# EAGLE design module (EAGLE 9.4.0)
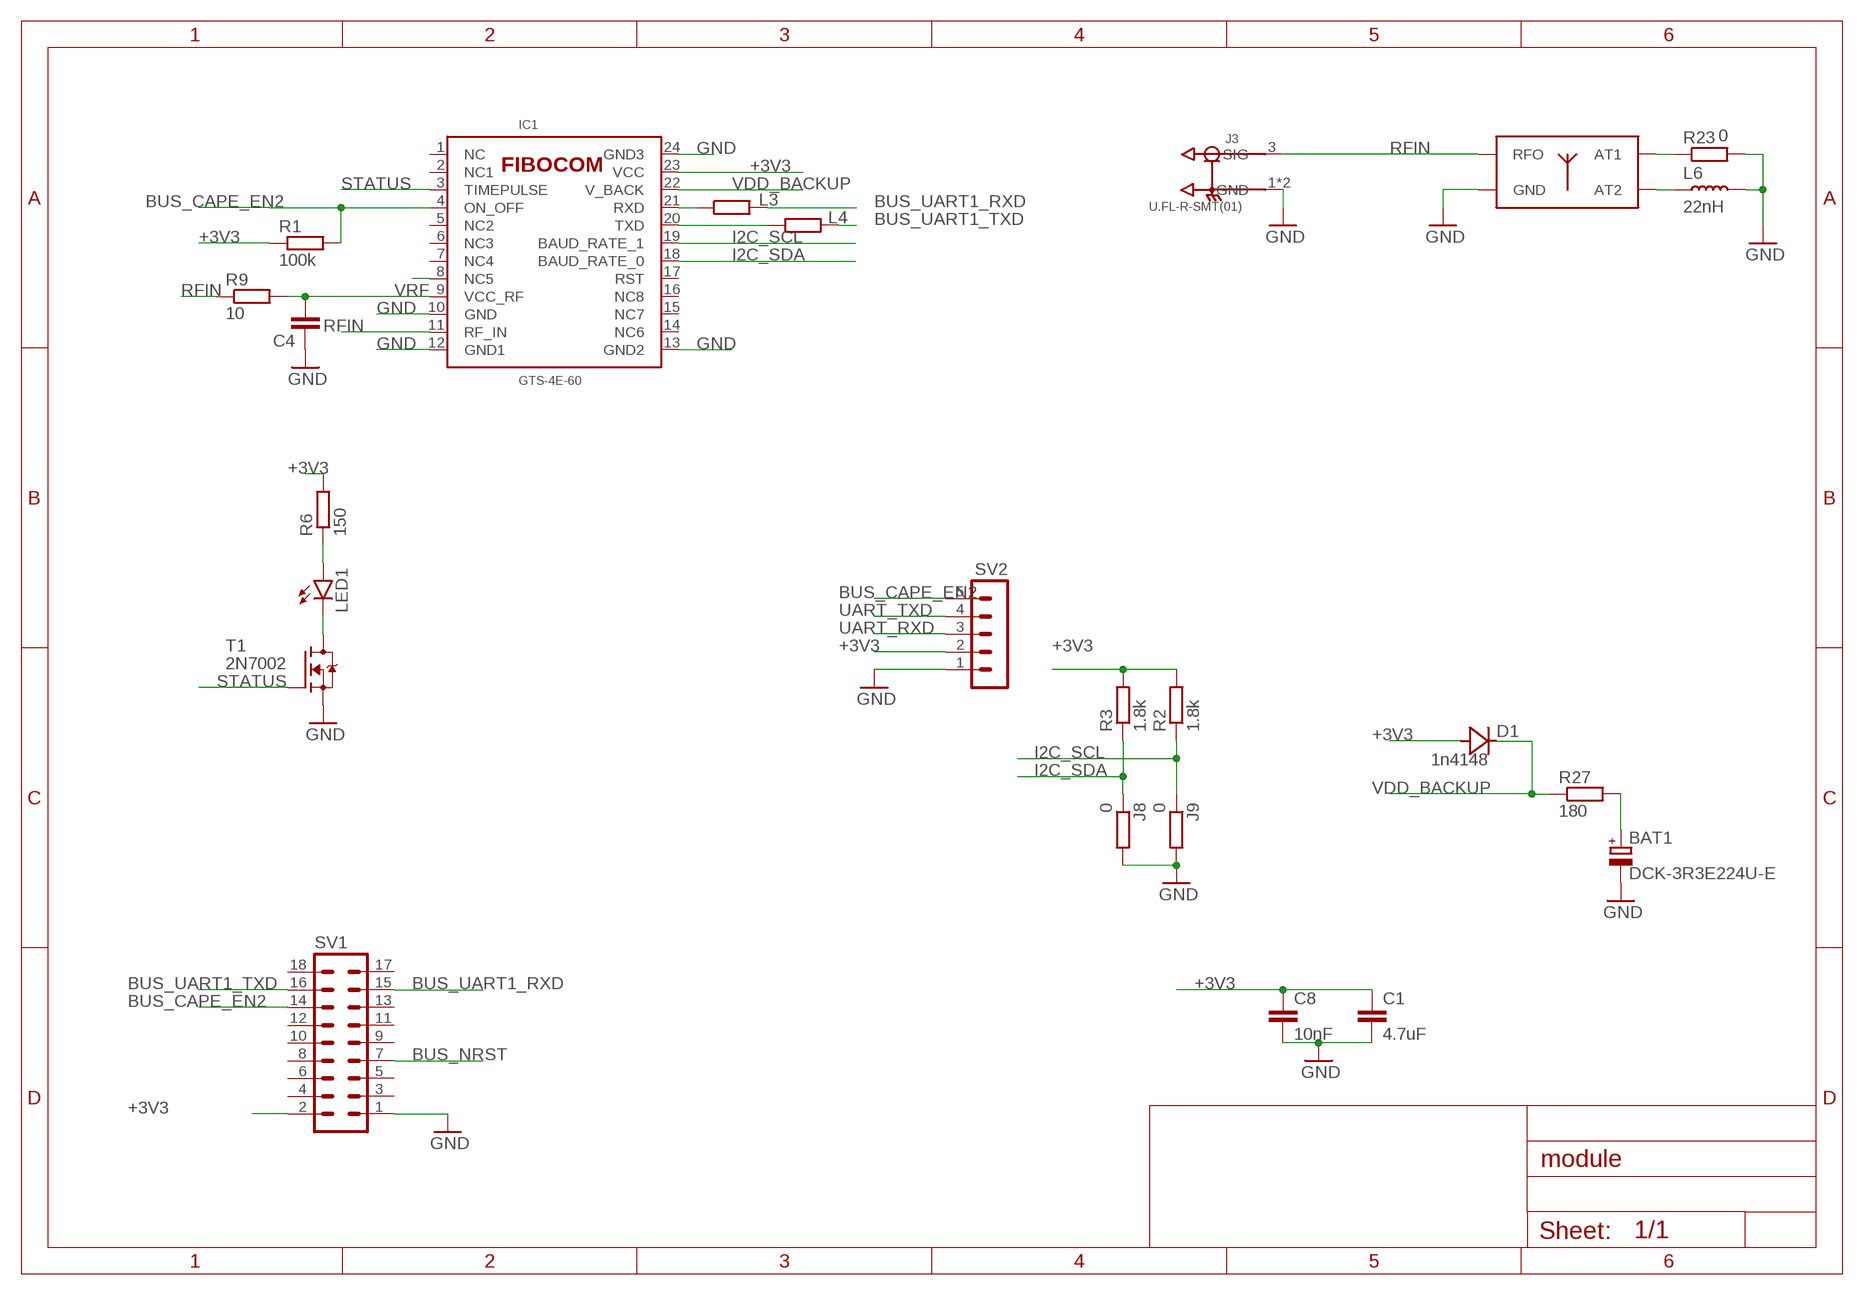
[diagram p0: schematic, sheet 1]

## Parts
ANT1  M20047  [PCBCOMPONENT_1]
BAT1  DCK-3R3E224U-E  [621]
C1  4.7uF  CAP-0603  [C0603]
C4  10nF  CAP-0402  [C0402K]
C8  10nF  CAP-0603  [C0603]
D1  1n4148  1N4148WS  [SOD323]
IC1  GTS-4E-60  [_GTS_4E_60]
J3  U.FL-R-SMT(01)  [HRS_U.FL-R-SMT(01)]
J8  0  RES-0603  [R0603]
J9  0  RES-0603  [R0603]
L3  blm15  RES-0603  [R0603]
L4  blm15  RES-0603  [R0603]
L6  22nH  IND-0402  [L0402]
LED1  LEDCHIP-LED0603  [CHIP-LED0603]
R1  100k  RES-0603  [R0603]
R2  1.8k  RES-0603  [R0603]
R3  1.8k  RES-0603  [R0603]
R6  150  RES-0603  [R0603]
R9  10  R-EU_R0402  [R0402]
R23  0  R-EU_R0402  [R0402]
R27  180  RES-0603  [R0603]
SV1  MA09-2  [MA09-2]
SV2  MA05-1  [MA05-1]
T1  2N7002  [SOT95P240X110-3]

## Nets
+3V3: C1.1 C8.1 D1.A IC1.23(VCC) R1.1 R2.2 R3.2 R6.2 SV1.2 SV2.2
BUS_CAPE_EN2: IC1.4(ON_OFF) R1.2 SV1.14 SV2.5
BUS_NRST: SV1.7
BUS_UART1_RXD: L3.2 SV1.15
BUS_UART1_TXD: L4.2 SV1.16
GND: ANT1.2(GND) ANT1.3(GND) ANT1.4(GND) BAT1.- C1.2 C4.1 C8.2 IC1.10(GND) IC1.12(GND1) IC1.13(GND2) IC1.24(GND3) J3.1(GND) J3.2(GND) J8.2 J9.2 L6.2 R23.2 SV1.1 SV2.1 T1.2(S)
I2C_SCL: IC1.19(BAUD_RATE_1) J9.1 R2.1
I2C_SDA: IC1.18(BAUD_RATE_0) J8.1 R3.1
N$1: IC1.8(NC5)
N$6: LED1.C T1.3(D)
N$12: LED1.A R6.1
N$17: ANT1.1(AT1) R23.1
N$18: ANT1.6(AT2) L6.1
N$20: BAT1.+ R27.2
RFIN: ANT1.5(RFO) IC1.11(RF_IN) J3.3(SIG) R9.1
STATUS: IC1.3(TIMEPULSE) T1.1(G)
UART_RXD: IC1.20(TXD) L4.1 SV2.3
UART_TXD: IC1.21(RXD) L3.1 SV2.4
VDD_BACKUP: D1.K(C) IC1.22(V_BACK) R27.1
VRF: C4.2 IC1.9(VCC_RF) R9.2
Unconnected: IC1.1(NC) IC1.2(NC1) IC1.5(NC2) IC1.6(NC3) IC1.7(NC4) IC1.14(NC6) IC1.15(NC7) IC1.16(NC8) IC1.17(RST) SV1.3 SV1.4 SV1.5 SV1.6 SV1.8 SV1.9 SV1.10 SV1.11 SV1.12 SV1.13 SV1.17 SV1.18

## Library data of the parts
ANT1 = parts-antenova:M20047
BAT1 = parts-elna:DCK-3R3E224U-E
C1 C8 = parts-passives:CAP-; PACKAGE: 0603; RATING: 10V
C4 = parts-passives:CAP-; PACKAGE: 0402; RATING: 6V
D1 = parts-diotec:1N4148WS
IC1 = parts-fibocom:GTS-4E-60: The GTS-4E is a new generation of GPS receiving module. FIBOCOM GTS 4E 60
J3 = parts-molex:U.FL-R-SMT(01): U.FL Series 6 Ghz 50 Ohm Ultra-small SMT Coaxial Cable Receptacle; AVAILABILITY: Unavailable; DESCRIPTION: U.FL Series 6 Ghz 50 Ohm Ultra-small SMT Coaxial Cable Receptacle; MF: Hirose; MP: U.FL-R-SMT_01_; PACKAGE: None; PRICE: None
J8 J9 L3 L4 R1-R3 R6 R27 = parts-passives:RES-; PACKAGE: 0603
L6 = parts-passives:IND-; CURRENT: 10mA; PACKAGE: 0402
LED1 = led:LED: LED OSRAM: - CHIPLED LG R971, LG N971, LY N971, LG Q971, LY Q971, LO R971, LY R971 LH N974, LH R974 LS Q976, LO Q976, LY Q976 LO Q996 - Hyper CHIPLED LW Q18S LB Q993, LB Q99A, LB R99A - SideLED LS A670, LO A670, LY A670, LG A670, LP A670 LB A673, LV A673, LT A673, LW A673 LH A674 LY A675 LS A676, LA A676, LO A676, LY A676, LW A676 LS A679, LY A679, LG A679 - Hyper Micro SIDELED® LS Y876, LA Y876, LO Y876, LY Y876 LT Y87S - SmartLED LW L88C, LW L88S LB L89C, LB L89S, LG L890 LS L89K, LO L89K, LY L89K LS L896, LA L896, LO L896, LY L896 - TOPLED LS T670, LO T670, LY T670, LG T670, LP T670 LSG T670, LSP T670, LSY T670, LOP T670, LYG T670 LG T671, LOG T671, LSG T671 LB T673, LV T673, LT T673, LW T673 LH T674 LS T676, LA T676, LO T676, LY T676, LB T676, LH T676, LSB T676, LW T676 LB T67C, LV T67C, LT T67C, LS T67K, LO T67K, LY T67K, LW E67C LS E67B, LA E67B, LO E67B, LY E67B, LB E67C, LV E67C, LT E67C LW T67C LS T679, LY T679, LG T679 LS T770, LO T770, LY T770, LG T770, LP T770 LB T773, LV T773, LT T773, LW T773 LH T774 LS E675, LA E675, LY E675, LS T675 LS T776, LA T776, LO T776, LY T776, LB T776 LHGB T686 LT T68C, LB T68C - Hyper Mini TOPLED® LB M676 - Mini TOPLED Santana® LG M470 LS M47K, LO M47K, LY M47K Source: http://www.osram.convergy.de LUXEON: - LUMILED® LXK2-PW12-R00, LXK2-PW12-S00, LXK2-PW14-U00, LXK2-PW14-V00 LXK2-PM12-R00, LXK2-PM12-S00, LXK2-PM14-U00 LXK2-PE12-Q00, LXK2-PE12-R00, LXK2-PE12-S00, LXK2-PE14-T00, LXK2-PE14-U00 LXK2-PB12-K00, LXK2-PB12-L00, LXK2-PB12-M00, LXK2-PB14-N00, LXK2-PB14-P00, LXK2-PB14-Q00 LXK2-PR12-L00, LXK2-PR12-M00, LXK2-PR14-Q00, LXK2-PR14-R00 LXK2-PD12-Q00, LXK2-PD12-R00, LXK2-PD12-S00 LXK2-PH12-R00, LXK2-PH12-S00 LXK2-PL12-P00, LXK2-PL12-Q00, LXK2-PL12-R00 Source: www.luxeon.com KINGBRIGHT: KA-3528ASYC Source: www.kingbright.com
R9 R23 = rcl:R-EU_: RESISTOR, European symbol; SPICEPREFIX: R
SV1 = con-lstb:MA09-2: PIN HEADER; OC_FARNELL: unknown; OC_NEWARK: unknown
SV2 = parts-passives:MA05-1: PIN HEADER; OC_FARNELL: unknown; OC_NEWARK: unknown
T1 = parts-onsemi:2N7002

## Net classes
1 50_feed: width 1 mm, clearance 0.4 mm
2 usb_dif: width 0.4 mm, clearance 0.8 mm

## Board
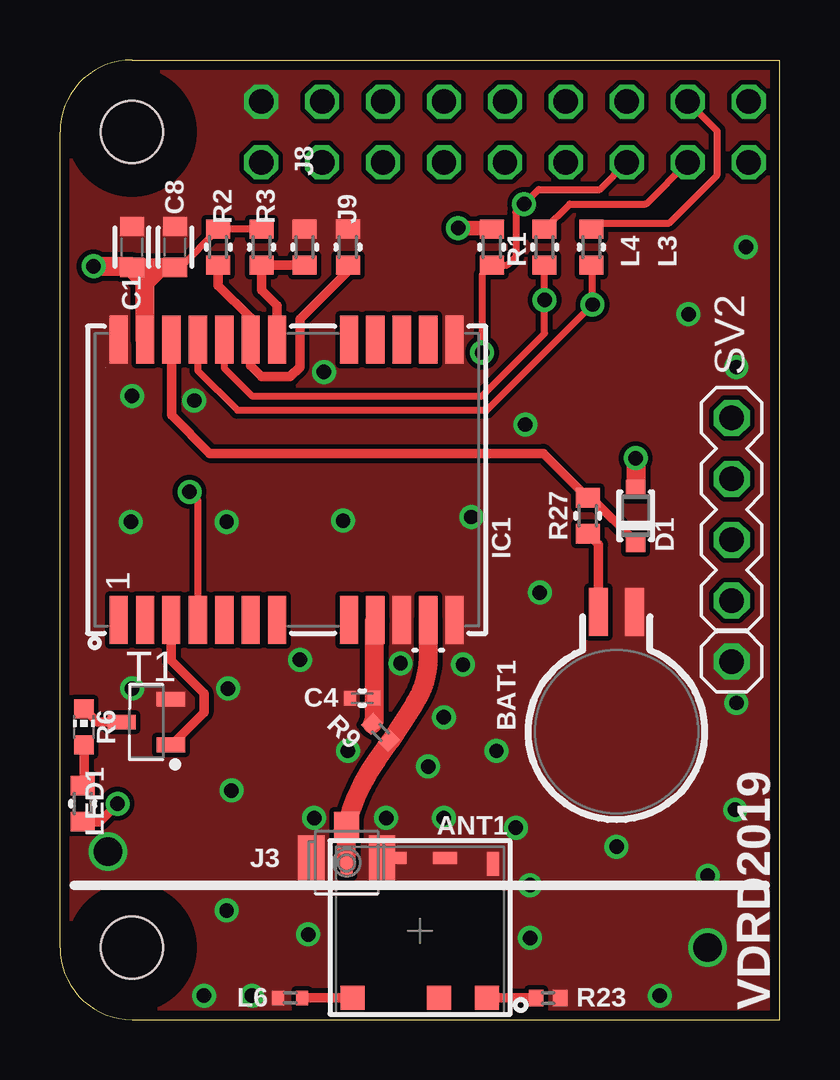
[diagram p1: board, top side]
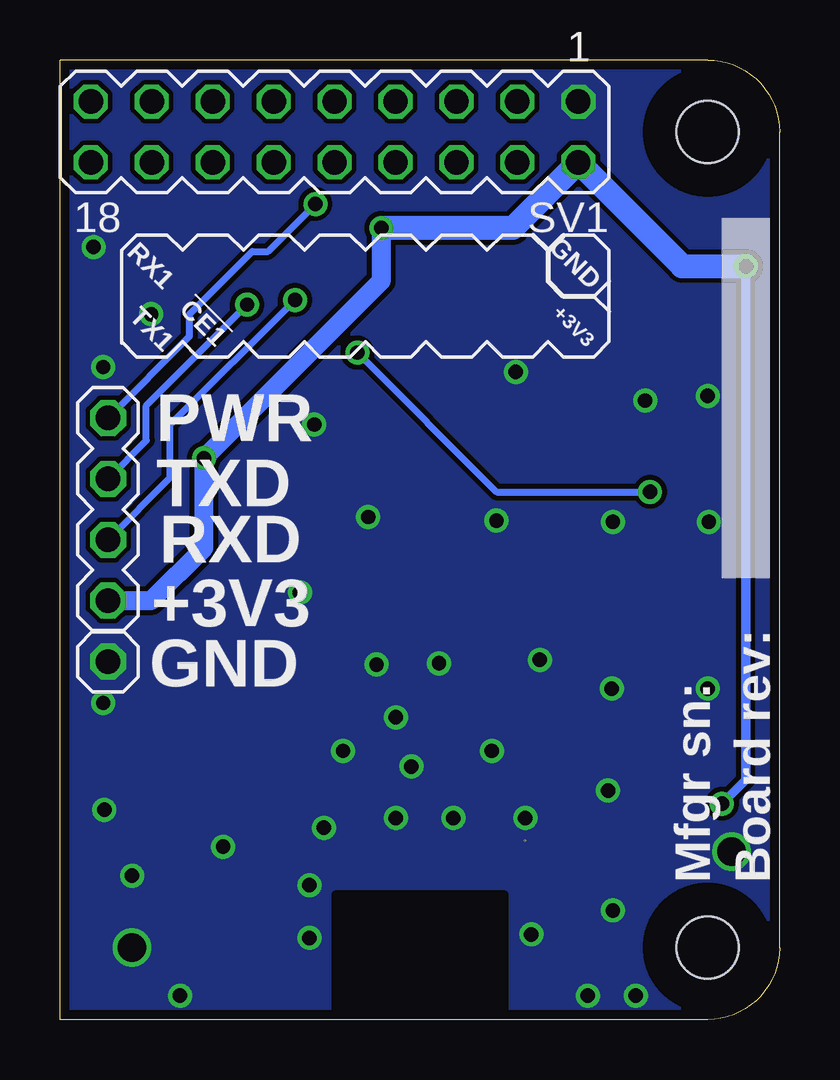
[diagram p2: board, bottom side, seen from below]

Size 30 x 40 mm. Coordinates in mm from the lower left corner, seen from the top.
Outline: 3,40 30,40 30,0 3,0 arc-90 0,3 0,37 arc-90 3,40
Copper layers (1*16): Top 0.035mm / dielectric 0.53mm / Bottom 0.035mm
Design rules "default *": minimum track width 0.2mm, minimum drill 0.6mm, track to track 0.2mm, track to pad 0.2mm, pad to pad 0.2mm, via to via 0.2mm, smd to smd 6mil, copper to edge 0.4mm, drill to drill 0.2mm, minimum pad ring 0.2mm, minimum via ring 0.2mm, stop-mask expansion 0.1mm, vias tented up to drill 0.6mm, thermal gap 10mil
Holes 2.6 mm at 3,37 3,3
tRestrict: area 0.5,34.5 to 5.5,39.5; area 0.5,0.5 to 5.5,5.5
bRestrict: area 0.5,34.5 to 5.5,39.5; area 0.5,0.5 to 5.5,5.5

### Footprints (pad centres in the part's own frame; a part is rotated, then mirrored left to right if it is on the bottom)
PCBCOMPONENT_1 = smd 1 x 1: 1 -2.8,2.8; 6 2.8,2.8; 7 -0.8,2.8 | smd 0.5 x 1: 2 -3.05,-2.794; 5 3.05,-2.794 | smd 1 x 0.5: 3 -1.05,-3.048; 4 1.05,-3.048
621 = smd 0.8 x 2: + 0.75,-1.6; - -0.75,-1.6
C0603 = smd 0.8 x 1: 1 -0.85,0; 2 0.85,0
C0402K = smd 0.5 x 0.6: 1 -0.5,0; 2 0.5,0
SOD323 = smd 0.8 x 0.8: A 1.1,0; K -1.1,0
_GTS_4E_60 = smd 0.76 x 2: 1 -7,-5.85; 2 -5.9,-5.85; 3 -4.81,-5.85; 4 -3.7,-5.85; 5 -2.6,-5.85; 6 -1.5,-5.85; 7 -0.4,-5.85; 8 2.6,-5.85; 9 3.7,-5.85; 10 4.8,-5.85; 11 5.9,-5.85; 12 7,-5.85; 13 7,5.85; 14 5.9,5.85; 15 4.8,5.85; 16 3.7,5.85; 17 2.6,5.85; 18 -0.4,5.85; 19 -1.5,5.85; 20 -2.6,5.85; 21 -3.7,5.85; 22 -4.8,5.85; 23 -5.9,5.85; 24 -7,5.85
HRS_U.FL-R-SMT(01) = smd 1.1 x 2.25: 1 -1.475,0; 2 1.475,0 | smd 1.05 x 1.1: 3 0,-1.55
R0603 = smd 0.8 x 1: 1 -0.75,0; 2 0.75,0
L0402 = smd 0.5 x 0.6: 1 -0.5,0; 2 0.5,0
CHIP-LED0603 = smd 0.8 x 0.8: A 0,-0.75; C 0,0.75
R0402 = smd 0.6 x 0.7: 1 -0.5,0; 2 0.5,0
MA09-2 = drill 1.016 octagon: 1 -10.16,-1.27; 2 -10.16,1.27; 3 -7.62,-1.27; 4 -7.62,1.27; 5 -5.08,-1.27; 6 -5.08,1.27; 7 -2.54,-1.27; 8 -2.54,1.27; 9 0,-1.27; 10 0,1.27; 11 2.54,-1.27; 12 2.54,1.27; 13 5.08,-1.27; 14 5.08,1.27; 15 7.62,-1.27; 16 7.62,1.27; 17 10.16,-1.27; 18 10.16,1.27
MA05-1 = drill 1.016 pad 1.5 octagon: 1 -5.08,0; 2 -2.54,0; 3 0,0; 4 2.54,0; 5 5.08,0
SOT95P240X110-3 = smd 1.18 x 0.609: 1 -1.024,0.95; 2 -1.024,-0.95; 3 1.024,0

### Placement (x,y rotation side)
ANT1  15,3.7 180 top
BAT1  23.2,15.4 180 top
C1  3,32.2 90 top
C4  12.6,13.4 0 top
C8  4.8,32.2 90 top
D1  24,21 90 top
IC1  9.45,22.5 0 top
J3  11.95,6.55 180 top
J8  10.2,32.2 90 top
J9  12,32.2 90 top
L3  22.15,32.2 90 top
L4  20.2,32.2 90 top
L6  9.6,0.9 180 top
LED1  1,12.2 0 top
R1  18,32.2 270 top
R2  6.6,32.2 90 top
R3  8.4,32.2 90 top
R6  0.95,9 270 top
R9  13.36,11.96 135 top
R23  20.35,0.9 0 top
R27  22,21 270 top
SV1  18.55,37 180 bottom
SV2  28,20 90 top
T1  3.6,12.4 180 top

### Tracks (layer width: path | path; a pad name or v marks a point on that pad's centre or on a via)
+3V3  (via drill 0.6)
  Top 0.3: 5,31.35 C8.1 5,31.35 | 5,31.35 R2.2 | 5,31.35 R2.2 | R3.2 R2.2
  Top 0.4: R6.2 1.65,8.25 v2.4,9
  Top 0.6: v16.6,33 17.95,33 R1.1
  Top 0.8: v1.4,31.4 2.95,31.4 | 2.95,31.4 C1.1 | IC1.23 3.55,30.75 | 3.55,30.75 4.15,31.35 C8.1 C1.1 | C1.1 2.95,31.4 | 3.55,30.75 3,31.3 C1.1 | v24,23.4 D1.A
  Bottom 0.4: v2.4,9 1.4,10 v1.4,31.4
  Bottom 0.8: SV2.2 26.2,17.46 24,19.66 v24,23.4 16.6,30.8 v16.6,33
  Bottom 1: v1.4,31.4 4.06,31.4 SV1.2 11.12,33 v16.6,33
BUS_CAPE_EN2  (via drill 0.6)
  Top 0.3: v17.6,27.8 17.6,31.05 R1.2 18.65,31.45 19,31.8 19,33.65 v19.35,34 19.95,34.6 22.5,34.6 SV1.14 | v5.4,22 5.75,21.65 IC1.4
  Bottom 0.3: SV2.5 24.6,28.48 24.6,29.4 21.98,32.02 21.33,32.02 v19.35,34 | v17.6,27.8 11.8,22 v5.4,22
BUS_UART1_RXD
  Top 0.3: L3.2 22.4,33.2 25.4,33.2 27.4,35.2 27.4,37.04 SV1.15
BUS_UART1_TXD
  Top 0.3: L4.2 21.25,34 24.4,34 24.44,34 SV1.16
GND  (via drill 0.6, 1.2)
  other vias: 27,3 2,7 28.15,8.75 19.4,24.8 11.8,20.8 5.6,25.8 13.6,8.4 19,8 23.2,7.2 7,13.8 26.2,29.4 20,17.8 28.2,13.2 3,13.8 6.95,4.55 7.15,9.55 15.35,10.55 2.95,20.75 6.95,20.75 10.35,3.55 19.6,5.6 19.6,3.4 16,8.4 28.2,27.2 28.6,32.2 18.2,11.2 25,1 8,1 6,1 11,27 3,26 27,6 17.15,20.95 10,15 16.8,14.8 16,12.6 14.2,14.85 12,11.2 10.6,8.4
  pour Bottom (isolate 0.2, no thermals): -1,-1 31,-1 31,41 -1,41
  pour Top (isolate 0.2, rank 6, no thermals): -2,-2 32,-2 32,42 -2,42
I2C_SCL
  Top 0.4: R2.1 6.6,30.6 7.95,29.25 IC1.19 7.95,27.25 8.4,26.8 9.6,26.8 10,27.2 10,29.2 12,31.2 J9.1
I2C_SDA
  Top 0.4: IC1.18 9.05,29.75 8.4,30.4 R3.1 J8.1
N$6
  Top 0.4: T1.3 1.55,12.4 LED1.C
N$12
  Top 0.4: LED1.A 1,9.8 R6.1
N$17
  Top 0.4: ANT1.1 R23.1
N$18
  Top 0.4: ANT1.6 L6.1
N$20
  Top 0.4: R27.2 22.45,19.8 BAT1.+
RFIN
  Top 0.3: R9.1 13.2,11.09 13.2,10.8
  Top 0.8: IC1.11 15.35,15.15 arc-32 14.8,13.2 arc-4 13.2,10.8 arc22 J3.3 ANT1.5
STATUS
  Top 0.4: T1.1 4.65,11.45 6,12.8 6,13.6 4.64,14.96 IC1.3
UART_RXD  (via drill 0.6)
  Top 0.3: IC1.20 6.85,27.15 8,26 17.6,26 20.2,28.6 v20.2,30 L4.1
  Bottom 0.3: SV2.3 25.4,22.6 25.4,24.8 v20.2,30
UART_TXD  (via drill 0.6)
  Top 0.3: IC1.21 5.75,27.05 7.4,25.4 17.8,25.4 v22.2,29.8 22.2,31.4 L3.1
  Bottom 0.3: SV2.4 26.4,24.14 26.4,25.6 v22.2,29.8
VDD_BACKUP
  Top 0.4: D1.K 22.15,21.75 R27.1 20.15,23.6 6.25,23.6 4.65,25.2 IC1.22
VRF
  Top 0.8: IC1.9 13.1,16.6 C4.2 | C4.2 | C4.2 13.1,12.45 R9.2

### Text on the board
tPlace: VDRD2019
bPlace: GND | RX1 | !CE1 | +3V3 | TX1
bNames: PWR | TXD | RXD | +3V3 | GND | Board rev: | Mfgr sn:
Measures: 1.2 | 2.6